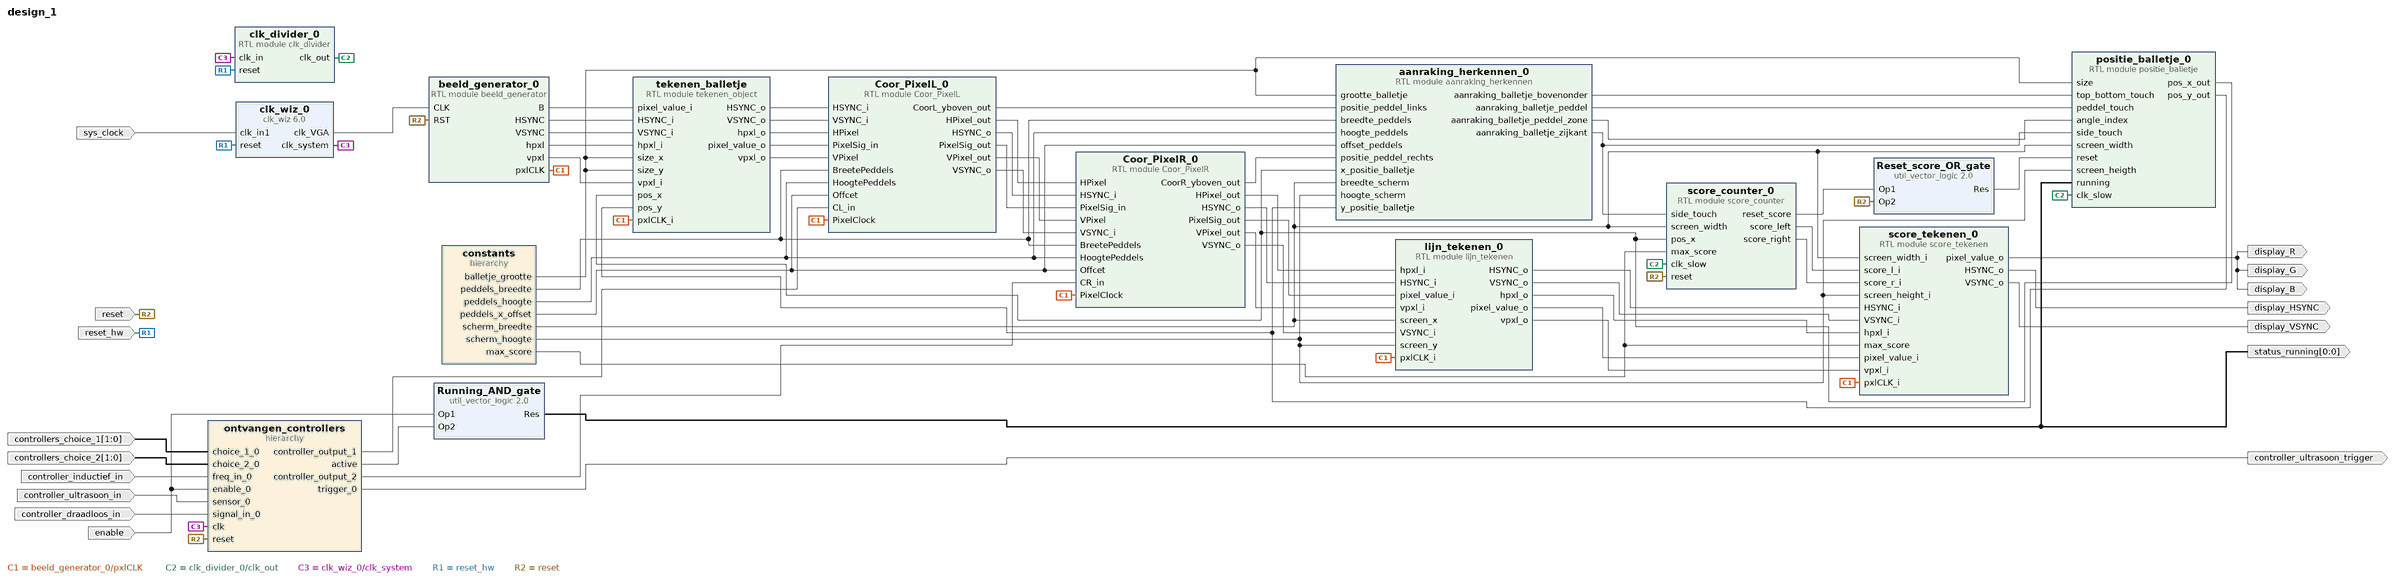
[diagram p0: block diagram of the top level]
# Vivado block design design_1, xc7z020clg400-1, Vivado 2023.1
create_bd_design design_1

create_bd_port -dir I -type rst reset
set_property -dict {CONFIG.POLARITY ACTIVE_HIGH} [get_bd_ports reset]
create_bd_port -dir I enable
create_bd_port -dir I -from 1 -to 0 controllers_choice_1
create_bd_port -dir I -from 1 -to 0 controllers_choice_2
create_bd_port -dir I controller_inductief_in
create_bd_port -dir I controller_ultrasoon_in
create_bd_port -dir O controller_ultrasoon_trigger
create_bd_port -dir O -from 0 -to 0 status_running
create_bd_port -dir O display_B
create_bd_port -dir O display_G
create_bd_port -dir O display_R
create_bd_port -dir O display_HSYNC
create_bd_port -dir O display_VSYNC
create_bd_port -dir I -type clk sys_clock
set_property -dict {CONFIG.FREQ_HZ 125000000 CONFIG.PHASE 0.0} [get_bd_ports sys_clock]
create_bd_port -dir I -type rst reset_hw
set_property -dict {CONFIG.POLARITY ACTIVE_HIGH} [get_bd_ports reset_hw]
create_bd_port -dir I controller_draadloos_in

create_bd_cell -type hier ontvangen_controllers
create_bd_cell -type module -reference clk_divider clk_divider_0
set_property -dict {CONFIG.division 750000} [get_bd_cells clk_divider_0]
create_bd_cell -type ip -vlnv xilinx.com:ip:util_vector_logic:2.0 Running_AND_gate
set_property -dict {CONFIG.C_SIZE 1} [get_bd_cells Running_AND_gate]
create_bd_cell -type module -reference beeld_generator beeld_generator_0
create_bd_cell -type hier constants
create_bd_cell -type module -reference lijn_tekenen lijn_tekenen_0
set_property -dict {CONFIG.width_line 3} [get_bd_cells lijn_tekenen_0]
create_bd_cell -type module -reference tekenen_object tekenen_balletje
create_bd_cell -type ip -vlnv xilinx.com:ip:clk_wiz:6.0 clk_wiz_0
set_property -dict [list \
  CONFIG.CLKOUT2_JITTER 143.688 \
  CONFIG.CLKOUT2_PHASE_ERROR 96.948 \
  CONFIG.CLKOUT2_REQUESTED_OUT_FREQ 50 \
  CONFIG.CLKOUT2_USED true \
  CONFIG.CLK_IN1_BOARD_INTERFACE sys_clock \
  CONFIG.CLK_OUT1_PORT clk_system \
  CONFIG.CLK_OUT2_PORT clk_VGA \
  CONFIG.MMCM_CLKOUT1_DIVIDE 20 \
  CONFIG.NUM_OUT_CLKS 2 \
  CONFIG.USE_BOARD_FLOW true \
  CONFIG.USE_LOCKED false \
  CONFIG.USE_RESET true \
] [get_bd_cells clk_wiz_0]
create_bd_cell -type module -reference Coor_PixelR Coor_PixelR_0
create_bd_cell -type module -reference score_tekenen score_tekenen_0
set_property -dict {CONFIG.distance 5 CONFIG.size 10 CONFIG.width_offset 20} [get_bd_cells score_tekenen_0]
create_bd_cell -type module -reference aanraking_herkennen aanraking_herkennen_0
create_bd_cell -type module -reference score_counter score_counter_0
create_bd_cell -type ip -vlnv xilinx.com:ip:util_vector_logic:2.0 Reset_score_OR_gate
set_property -dict {CONFIG.C_OPERATION or CONFIG.C_SIZE 1} [get_bd_cells Reset_score_OR_gate]
create_bd_cell -type module -reference Coor_PixelL Coor_PixelL_0
create_bd_cell -type module -reference positie_balletje positie_balletje_0
set_property -dict {CONFIG.step_y 1} [get_bd_cells positie_balletje_0]

# ---- hierarchy /ontvangen_controllers ----
current_bd_instance /ontvangen_controllers
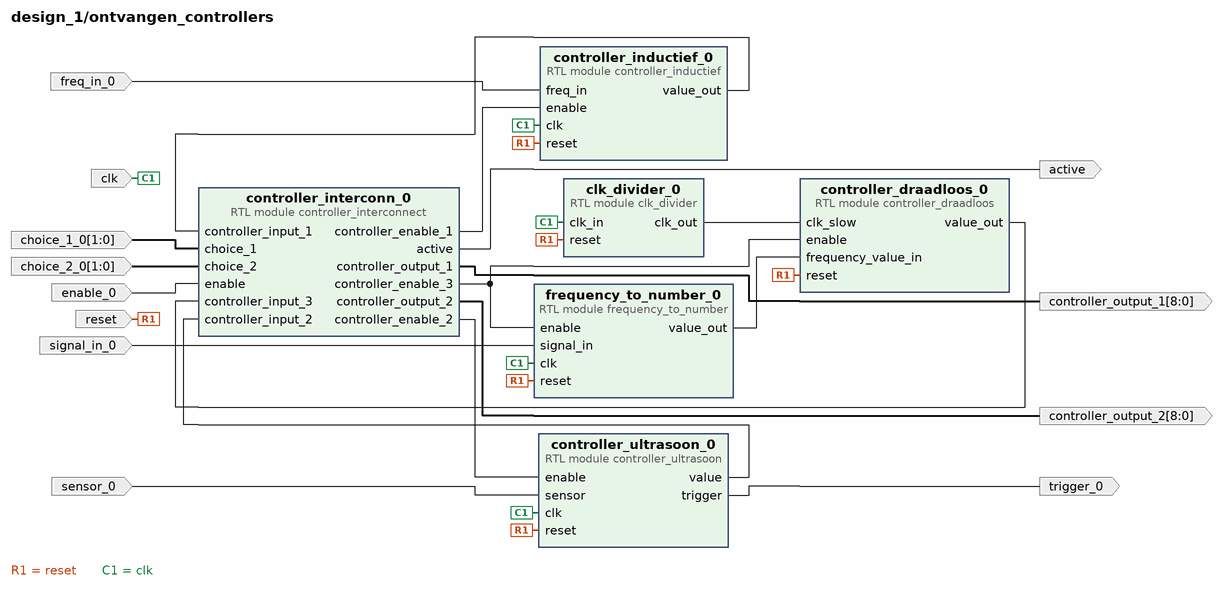
[diagram p1: block diagram inside /ontvangen_controllers]
create_bd_pin -dir I -type rst reset
create_bd_pin -dir I -type clk clk
create_bd_pin -dir I enable_0
create_bd_pin -dir I -from 1 -to 0 choice_1_0
create_bd_pin -dir I -from 1 -to 0 choice_2_0
create_bd_pin -dir I freq_in_0
create_bd_pin -dir I sensor_0
create_bd_pin -dir O trigger_0
create_bd_pin -dir O -from 8 -to 0 controller_output_1
create_bd_pin -dir O -from 8 -to 0 controller_output_2
create_bd_pin -dir O active
create_bd_pin -dir I signal_in_0

create_bd_cell -type module -reference controller_interconnect controller_interconn_0
create_bd_cell -type module -reference controller_inductief controller_inductief_0
create_bd_cell -type module -reference clk_divider clk_divider_0
set_property -dict {CONFIG.division 200000} [get_bd_cells clk_divider_0]
create_bd_cell -type module -reference controller_ultrasoon controller_ultrasoon_0
create_bd_cell -type module -reference controller_draadloos controller_draadloos_0
create_bd_cell -type module -reference frequency_to_number frequency_to_number_0

# ---- hierarchy /constants ----
current_bd_instance /constants
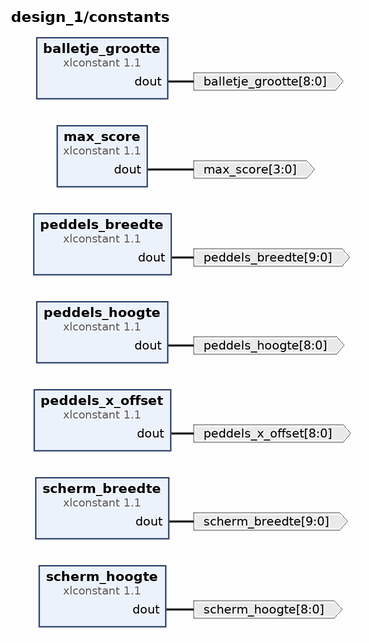
[diagram p2: block diagram inside /constants]
create_bd_pin -dir O -from 8 -to 0 scherm_hoogte
create_bd_pin -dir O -from 9 -to 0 scherm_breedte
create_bd_pin -dir O -from 8 -to 0 peddels_x_offset
create_bd_pin -dir O -from 8 -to 0 peddels_hoogte
create_bd_pin -dir O -from 8 -to 0 balletje_grootte
create_bd_pin -dir O -from 9 -to 0 peddels_breedte
create_bd_pin -dir O -from 3 -to 0 max_score

create_bd_cell -type ip -vlnv xilinx.com:ip:xlconstant:1.1 peddels_hoogte
set_property -dict {CONFIG.CONST_VAL 80 CONFIG.CONST_WIDTH 9} [get_bd_cells peddels_hoogte]
create_bd_cell -type ip -vlnv xilinx.com:ip:xlconstant:1.1 peddels_breedte
set_property -dict {CONFIG.CONST_VAL 20 CONFIG.CONST_WIDTH 10} [get_bd_cells peddels_breedte]
create_bd_cell -type ip -vlnv xilinx.com:ip:xlconstant:1.1 scherm_hoogte
set_property -dict {CONFIG.CONST_VAL 480 CONFIG.CONST_WIDTH 9} [get_bd_cells scherm_hoogte]
create_bd_cell -type ip -vlnv xilinx.com:ip:xlconstant:1.1 peddels_x_offset
set_property -dict {CONFIG.CONST_VAL 0 CONFIG.CONST_WIDTH 9} [get_bd_cells peddels_x_offset]
create_bd_cell -type ip -vlnv xilinx.com:ip:xlconstant:1.1 scherm_breedte
set_property -dict {CONFIG.CONST_VAL 640 CONFIG.CONST_WIDTH 10} [get_bd_cells scherm_breedte]
create_bd_cell -type ip -vlnv xilinx.com:ip:xlconstant:1.1 balletje_grootte
set_property -dict {CONFIG.CONST_VAL 8 CONFIG.CONST_WIDTH 9} [get_bd_cells balletje_grootte]
create_bd_cell -type ip -vlnv xilinx.com:ip:xlconstant:1.1 max_score
set_property -dict {CONFIG.CONST_VAL 5 CONFIG.CONST_WIDTH 4} [get_bd_cells max_score]

# ---- connections ----

current_bd_instance /ontvangen_controllers
connect_bd_net [get_bd_pins reset] \
  [get_bd_pins controller_inductief_0/reset] [get_bd_pins clk_divider_0/reset] [get_bd_pins controller_ultrasoon_0/reset] \
  [get_bd_pins controller_draadloos_0/reset] [get_bd_pins frequency_to_number_0/reset]
connect_bd_net [get_bd_pins clk] \
  [get_bd_pins controller_inductief_0/clk] [get_bd_pins clk_divider_0/clk_in] [get_bd_pins controller_ultrasoon_0/clk] \
  [get_bd_pins frequency_to_number_0/clk]
connect_bd_net -net choice_1_0_1 [get_bd_pins choice_1_0] [get_bd_pins controller_interconn_0/choice_1]
connect_bd_net -net choice_2_0_1 [get_bd_pins choice_2_0] [get_bd_pins controller_interconn_0/choice_2]
connect_bd_net [get_bd_pins clk_divider_0/clk_out] [get_bd_pins controller_draadloos_0/clk_slow]
connect_bd_net [get_bd_pins controller_draadloos_0/value_out] [get_bd_pins controller_interconn_0/controller_input_3]
connect_bd_net [get_bd_pins controller_inductief_0/value_out] [get_bd_pins controller_interconn_0/controller_input_1]
connect_bd_net [get_bd_pins controller_interconn_0/active] [get_bd_pins active]
connect_bd_net [get_bd_pins controller_interconn_0/controller_enable_1] [get_bd_pins controller_inductief_0/enable]
connect_bd_net [get_bd_pins controller_interconn_0/controller_enable_2] [get_bd_pins controller_ultrasoon_0/enable]
connect_bd_net [get_bd_pins controller_interconn_0/controller_enable_3] \
  [get_bd_pins controller_draadloos_0/enable] [get_bd_pins frequency_to_number_0/enable]
connect_bd_net [get_bd_pins controller_interconn_0/controller_output_1] [get_bd_pins controller_output_1]
connect_bd_net [get_bd_pins controller_interconn_0/controller_output_2] [get_bd_pins controller_output_2]
connect_bd_net [get_bd_pins controller_ultrasoon_0/trigger] [get_bd_pins trigger_0]
connect_bd_net [get_bd_pins controller_ultrasoon_0/value] [get_bd_pins controller_interconn_0/controller_input_2]
connect_bd_net -net enable_0_1 [get_bd_pins enable_0] [get_bd_pins controller_interconn_0/enable]
connect_bd_net -net freq_in_0_1 [get_bd_pins freq_in_0] [get_bd_pins controller_inductief_0/freq_in]
connect_bd_net [get_bd_pins frequency_to_number_0/value_out] [get_bd_pins controller_draadloos_0/frequency_value_in]
connect_bd_net -net sensor_0_1 [get_bd_pins sensor_0] [get_bd_pins controller_ultrasoon_0/sensor]
connect_bd_net -net signal_in_0_1 [get_bd_pins signal_in_0] [get_bd_pins frequency_to_number_0/signal_in]

current_bd_instance /constants
connect_bd_net [get_bd_pins balletje_grootte/dout] [get_bd_pins balletje_grootte]
connect_bd_net [get_bd_pins max_score/dout] [get_bd_pins max_score]
connect_bd_net [get_bd_pins peddels_breedte/dout] [get_bd_pins peddels_breedte]
connect_bd_net [get_bd_pins peddels_hoogte/dout] [get_bd_pins peddels_hoogte]
connect_bd_net [get_bd_pins peddels_x_offset/dout] [get_bd_pins peddels_x_offset]
connect_bd_net [get_bd_pins scherm_breedte/dout] [get_bd_pins scherm_breedte]
connect_bd_net [get_bd_pins scherm_hoogte/dout] [get_bd_pins scherm_hoogte]

current_bd_instance /
connect_bd_net [get_bd_pins Coor_PixelL_0/CoorL_yboven_out] [get_bd_pins aanraking_herkennen_0/positie_peddel_links]
connect_bd_net [get_bd_pins Coor_PixelL_0/HPixel_out] [get_bd_pins Coor_PixelR_0/HPixel]
connect_bd_net [get_bd_pins Coor_PixelL_0/HSYNC_o] [get_bd_pins Coor_PixelR_0/HSYNC_i]
connect_bd_net [get_bd_pins Coor_PixelL_0/PixelSig_out] [get_bd_pins Coor_PixelR_0/PixelSig_in]
connect_bd_net [get_bd_pins Coor_PixelL_0/VPixel_out] [get_bd_pins Coor_PixelR_0/VPixel]
connect_bd_net [get_bd_pins Coor_PixelL_0/VSYNC_o] [get_bd_pins Coor_PixelR_0/VSYNC_i]
connect_bd_net [get_bd_pins Coor_PixelR_0/CoorR_yboven_out] [get_bd_pins aanraking_herkennen_0/positie_peddel_rechts]
connect_bd_net [get_bd_pins Coor_PixelR_0/HPixel_out] [get_bd_pins lijn_tekenen_0/hpxl_i]
connect_bd_net [get_bd_pins Coor_PixelR_0/HSYNC_o] [get_bd_pins lijn_tekenen_0/HSYNC_i]
connect_bd_net [get_bd_pins Coor_PixelR_0/PixelSig_out] [get_bd_pins lijn_tekenen_0/pixel_value_i]
connect_bd_net [get_bd_pins Coor_PixelR_0/VPixel_out] [get_bd_pins lijn_tekenen_0/vpxl_i]
connect_bd_net [get_bd_pins Coor_PixelR_0/VSYNC_o] [get_bd_pins lijn_tekenen_0/VSYNC_i]
connect_bd_net [get_bd_pins aanraking_herkennen_0/aanraking_balletje_bovenonder] [get_bd_pins positie_balletje_0/top_bottom_touch]
connect_bd_net [get_bd_pins aanraking_herkennen_0/aanraking_balletje_peddel] [get_bd_pins positie_balletje_0/peddel_touch]
connect_bd_net [get_bd_pins aanraking_herkennen_0/aanraking_balletje_peddel_zone] [get_bd_pins positie_balletje_0/angle_index]
connect_bd_net [get_bd_pins aanraking_herkennen_0/aanraking_balletje_zijkant] \
  [get_bd_pins score_counter_0/side_touch] [get_bd_pins positie_balletje_0/side_touch]
connect_bd_net [get_bd_pins beeld_generator_0/B] [get_bd_pins tekenen_balletje/pixel_value_i]
connect_bd_net [get_bd_pins beeld_generator_0/HSYNC] [get_bd_pins tekenen_balletje/HSYNC_i]
connect_bd_net [get_bd_pins beeld_generator_0/VSYNC] [get_bd_pins tekenen_balletje/VSYNC_i]
connect_bd_net [get_bd_pins beeld_generator_0/hpxl] [get_bd_pins tekenen_balletje/hpxl_i]
connect_bd_net [get_bd_pins beeld_generator_0/pxlCLK] \
  [get_bd_pins lijn_tekenen_0/pxlCLK_i] [get_bd_pins tekenen_balletje/pxlCLK_i] [get_bd_pins Coor_PixelR_0/PixelClock] \
  [get_bd_pins score_tekenen_0/pxlCLK_i] [get_bd_pins Coor_PixelL_0/PixelClock]
connect_bd_net [get_bd_pins beeld_generator_0/vpxl] [get_bd_pins tekenen_balletje/vpxl_i]
connect_bd_net -net choice_1_0_1 [get_bd_ports controllers_choice_1] [get_bd_pins ontvangen_controllers/choice_1_0]
connect_bd_net -net choice_2_0_1 [get_bd_ports controllers_choice_2] [get_bd_pins ontvangen_controllers/choice_2_0]
connect_bd_net [get_bd_pins clk_divider_0/clk_out] [get_bd_pins score_counter_0/clk_slow] [get_bd_pins positie_balletje_0/clk_slow]
connect_bd_net [get_bd_pins clk_wiz_0/clk_VGA] [get_bd_pins beeld_generator_0/CLK]
connect_bd_net -net clk_wiz_0_clk_out1 [get_bd_pins clk_wiz_0/clk_system] [get_bd_pins ontvangen_controllers/clk] [get_bd_pins clk_divider_0/clk_in]
connect_bd_net -net constants_dout [get_bd_pins constants/balletje_grootte] \
  [get_bd_pins tekenen_balletje/size_x] [get_bd_pins tekenen_balletje/size_y] \
  [get_bd_pins aanraking_herkennen_0/grootte_balletje] [get_bd_pins positie_balletje_0/size]
connect_bd_net -net constants_dout1 [get_bd_pins constants/peddels_breedte] \
  [get_bd_pins Coor_PixelR_0/BreetePeddels] [get_bd_pins aanraking_herkennen_0/breedte_peddels] \
  [get_bd_pins Coor_PixelL_0/BreetePeddels]
connect_bd_net -net constants_dout2 [get_bd_pins constants/peddels_hoogte] \
  [get_bd_pins Coor_PixelR_0/HoogtePeddels] [get_bd_pins aanraking_herkennen_0/hoogte_peddels] \
  [get_bd_pins Coor_PixelL_0/HoogtePeddels]
connect_bd_net -net constants_dout3 [get_bd_pins constants/peddels_x_offset] \
  [get_bd_pins Coor_PixelR_0/Offcet] [get_bd_pins aanraking_herkennen_0/offset_peddels] [get_bd_pins Coor_PixelL_0/Offcet]
connect_bd_net -net constants_dout4 [get_bd_pins constants/scherm_breedte] \
  [get_bd_pins lijn_tekenen_0/screen_x] [get_bd_pins score_tekenen_0/screen_width_i] \
  [get_bd_pins aanraking_herkennen_0/breedte_scherm] [get_bd_pins score_counter_0/screen_width] \
  [get_bd_pins positie_balletje_0/screen_width]
connect_bd_net -net constants_dout5 [get_bd_pins constants/scherm_hoogte] \
  [get_bd_pins lijn_tekenen_0/screen_y] [get_bd_pins score_tekenen_0/screen_height_i] \
  [get_bd_pins aanraking_herkennen_0/hoogte_scherm] [get_bd_pins positie_balletje_0/screen_heigth]
connect_bd_net [get_bd_pins constants/max_score] [get_bd_pins score_tekenen_0/max_score] [get_bd_pins score_counter_0/max_score]
connect_bd_net -net enable_0_1 [get_bd_ports enable] [get_bd_pins ontvangen_controllers/enable_0] [get_bd_pins Running_AND_gate/Op1]
connect_bd_net -net freq_in_0_1 [get_bd_ports controller_inductief_in] [get_bd_pins ontvangen_controllers/freq_in_0]
connect_bd_net [get_bd_pins lijn_tekenen_0/HSYNC_o] [get_bd_pins score_tekenen_0/HSYNC_i]
connect_bd_net [get_bd_pins lijn_tekenen_0/VSYNC_o] [get_bd_pins score_tekenen_0/VSYNC_i]
connect_bd_net [get_bd_pins lijn_tekenen_0/hpxl_o] [get_bd_pins score_tekenen_0/hpxl_i]
connect_bd_net [get_bd_pins lijn_tekenen_0/pixel_value_o] [get_bd_pins score_tekenen_0/pixel_value_i]
connect_bd_net [get_bd_pins lijn_tekenen_0/vpxl_o] [get_bd_pins score_tekenen_0/vpxl_i]
connect_bd_net [get_bd_pins ontvangen_controllers/active] [get_bd_pins Running_AND_gate/Op2]
connect_bd_net [get_bd_pins ontvangen_controllers/controller_output_1] [get_bd_pins Coor_PixelL_0/CL_in]
connect_bd_net [get_bd_pins ontvangen_controllers/controller_output_2] [get_bd_pins Coor_PixelR_0/CR_in]
connect_bd_net [get_bd_pins ontvangen_controllers/trigger_0] [get_bd_ports controller_ultrasoon_trigger]
connect_bd_net [get_bd_pins positie_balletje_0/pos_x_out] \
  [get_bd_pins tekenen_balletje/pos_x] [get_bd_pins aanraking_herkennen_0/x_positie_balletje] \
  [get_bd_pins score_counter_0/pos_x]
connect_bd_net [get_bd_pins positie_balletje_0/pos_y_out] [get_bd_pins tekenen_balletje/pos_y] [get_bd_pins aanraking_herkennen_0/y_positie_balletje]
connect_bd_net [get_bd_ports reset_hw] [get_bd_pins clk_divider_0/reset] [get_bd_pins clk_wiz_0/reset]
connect_bd_net -net reset_rtl_1 [get_bd_ports reset] \
  [get_bd_pins ontvangen_controllers/reset] [get_bd_pins beeld_generator_0/RST] [get_bd_pins score_counter_0/reset] \
  [get_bd_pins Reset_score_OR_gate/Op2]
connect_bd_net [get_bd_pins score_counter_0/reset_score] [get_bd_pins Reset_score_OR_gate/Op1]
connect_bd_net [get_bd_pins score_counter_0/score_left] [get_bd_pins score_tekenen_0/score_l_i]
connect_bd_net [get_bd_pins score_counter_0/score_right] [get_bd_pins score_tekenen_0/score_r_i]
connect_bd_net [get_bd_pins score_tekenen_0/HSYNC_o] [get_bd_ports display_HSYNC]
connect_bd_net [get_bd_pins score_tekenen_0/VSYNC_o] [get_bd_ports display_VSYNC]
connect_bd_net [get_bd_pins score_tekenen_0/pixel_value_o] [get_bd_ports display_B] [get_bd_ports display_G] [get_bd_ports display_R]
connect_bd_net -net sensor_0_1 [get_bd_ports controller_ultrasoon_in] [get_bd_pins ontvangen_controllers/sensor_0]
connect_bd_net -net signal_in_0_1 [get_bd_ports controller_draadloos_in] [get_bd_pins ontvangen_controllers/signal_in_0]
connect_bd_net [get_bd_ports sys_clock] [get_bd_pins clk_wiz_0/clk_in1]
connect_bd_net [get_bd_pins tekenen_balletje/HSYNC_o] [get_bd_pins Coor_PixelL_0/HSYNC_i]
connect_bd_net [get_bd_pins tekenen_balletje/VSYNC_o] [get_bd_pins Coor_PixelL_0/VSYNC_i]
connect_bd_net [get_bd_pins tekenen_balletje/hpxl_o] [get_bd_pins Coor_PixelL_0/HPixel]
connect_bd_net [get_bd_pins tekenen_balletje/pixel_value_o] [get_bd_pins Coor_PixelL_0/PixelSig_in]
connect_bd_net [get_bd_pins tekenen_balletje/vpxl_o] [get_bd_pins Coor_PixelL_0/VPixel]
connect_bd_net -net util_vector_logic_0_Res [get_bd_pins Running_AND_gate/Res] [get_bd_ports status_running] [get_bd_pins positie_balletje_0/running]
connect_bd_net -net util_vector_logic_1_Res [get_bd_pins Reset_score_OR_gate/Res] [get_bd_pins positie_balletje_0/reset]

validate_bd_design
save_bd_design
